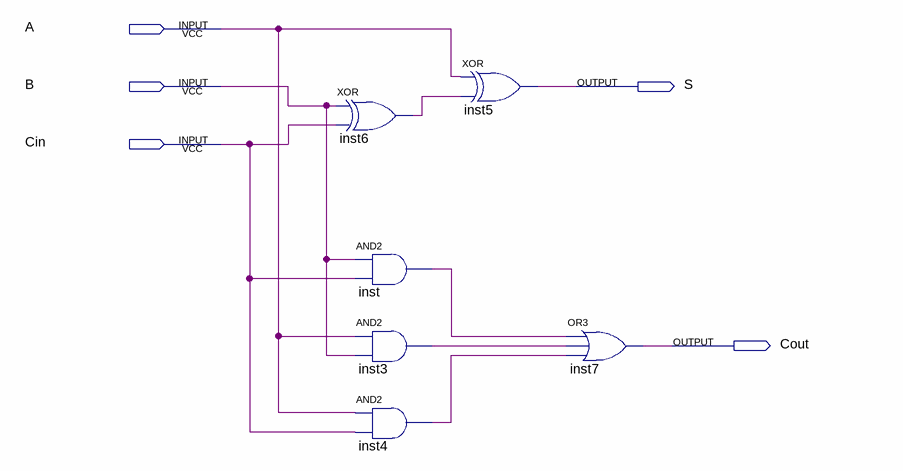
[diagram p0: schematic sheet]
// Quartus schematic adder.bdf as structural Verilog: 6 symbols, 5 pins
module adder (
  input  A,
  input  B,
  input  Cin,
  output S,
  output Cout
);

  wire inst3_out, inst4_out, inst6_out, inst_out;

  xor inst6 (inst6_out, B, Cin);
  and inst (inst_out, B, Cin);
  and inst3 (inst3_out, A, B);
  and inst4 (inst4_out, A, Cin);
  xor inst5 (S, A, inst6_out);
  or inst7 (Cout, inst_out, inst3_out, inst4_out);
endmodule
